# EAGLE design 7segement4digits1badidea-many-digits-mk-1 (EAGLE 6.5.0)
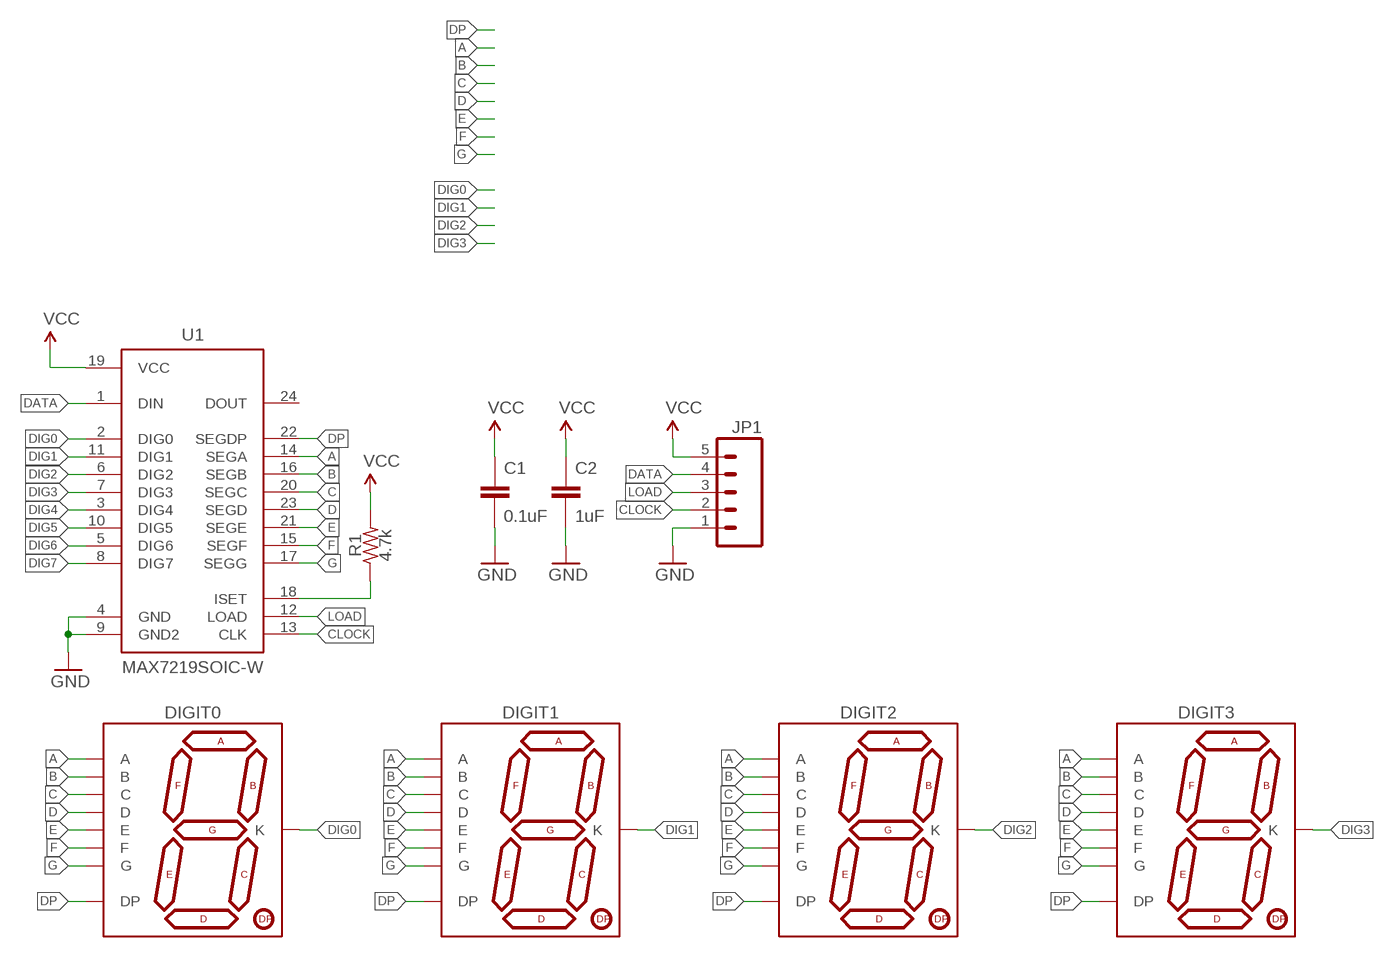
[diagram p0: schematic, sheet 1]

## Parts
C1  0.1uF  CAPACITOR-CERAMICC0603  [C0603]
C2  1uF  CAPACITOR-CERAMICC0805  [C0805]
DIGIT0  7SEG_1DIGPTH-10MM  [7SEG_1DIG_10MM]
DIGIT1  7SEG_1DIGPTH-10MM  [7SEG_1DIG_10MM]
DIGIT2  7SEG_1DIGPTH-10MM  [7SEG_1DIG_10MM]
DIGIT3  7SEG_1DIGPTH-10MM  [7SEG_1DIG_10MM]
JP1  M05JST-PH-VERT-PTH  [JST-5-PH-VERT-PTH]
R1  4.7k  RESISTORR0603  [R0603]
U1  MAX7219SOIC-W  [SO24W]

## Nets
A: DIGIT0.10(A) DIGIT1.10(A) DIGIT2.10(A) DIGIT3.10(A) U1.14(SEGA)
B: DIGIT0.9(B) DIGIT1.9(B) DIGIT2.9(B) DIGIT3.9(B) U1.16(SEGB)
C: DIGIT0.8(C) DIGIT1.8(C) DIGIT2.8(C) DIGIT3.8(C) U1.20(SEGC)
CLOCK: JP1.2 U1.13(CLK)
D: DIGIT0.5(D) DIGIT1.5(D) DIGIT2.5(D) DIGIT3.5(D) U1.23(SEGD)
DATA: JP1.4 U1.1(DIN)
DIG0: DIGIT0.1(K) DIGIT0.6(K) U1.2(DIG0)
DIG1: DIGIT1.1(K) DIGIT1.6(K) U1.11(DIG1)
DIG2: DIGIT2.1(K) DIGIT2.6(K) U1.6(DIG2)
DIG3: DIGIT3.1(K) DIGIT3.6(K) U1.7(DIG3)
DIG4: U1.3(DIG4)
DIG5: U1.10(DIG5)
DIG6: U1.5(DIG6)
DIG7: U1.8(DIG7)
DP: DIGIT0.7(DP) DIGIT1.7(DP) DIGIT2.7(DP) DIGIT3.7(DP) U1.22(SEGDP)
E: DIGIT0.4(E) DIGIT1.4(E) DIGIT2.4(E) DIGIT3.4(E) U1.21(SEGE)
F: DIGIT0.2(F) DIGIT1.2(F) DIGIT2.2(F) DIGIT3.2(F) U1.15(SEGF)
G: DIGIT0.3(G) DIGIT1.3(G) DIGIT2.3(G) DIGIT3.3(G) U1.17(SEGG)
GND: C1.2 C2.2 JP1.1 U1.4(GND) U1.9(GND2)
LOAD: JP1.3 U1.12(LOAD)
N$19: R1.1 U1.18(ISET)
VCC: C1.1 C2.1 JP1.5 R1.2 U1.19(VCC)
Unconnected: U1.24(DOUT)

## Library data of the parts
C1 C2 = A_butts:CAPACITOR-CERAMIC: CAPACITOR, European symbol
DIGIT0 DIGIT1-DIGIT3 = A_butts:7SEG_1DIG
JP1 = A_butts:M05: Header 5 Standard 5-pin 0.1" header. Use with straight break away headers (SKU : PRT-00116), right angle break away headers (PRT-00553), swiss pins (PRT-00743), machine pins (PRT-00117), and female headers (PRT-00115). Molex polarized connector foot print use with SKU : PRT-08230 with associated crimp pins and housings.
R1 = A_butts:RESISTOR: RESISTOR, American symbol
U1 = A_butts:MAX7219: 8-digit, 8-segment LED display driver, serial input

## Board
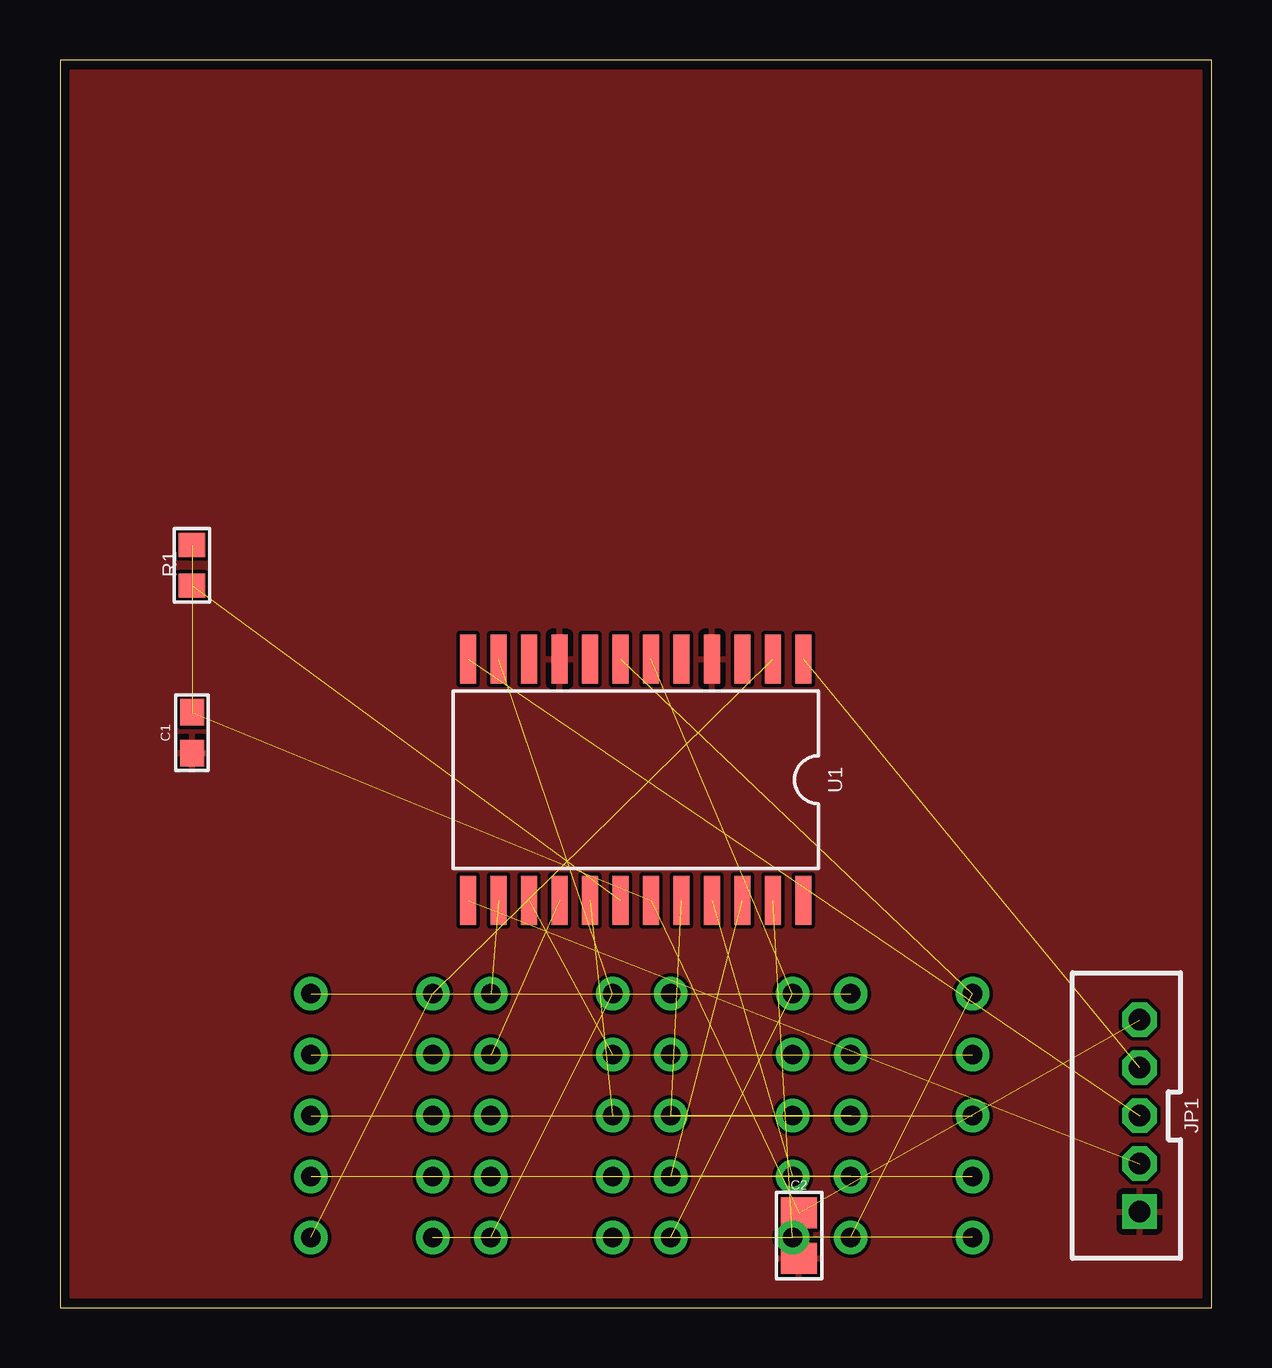
[diagram p1: board, top side]
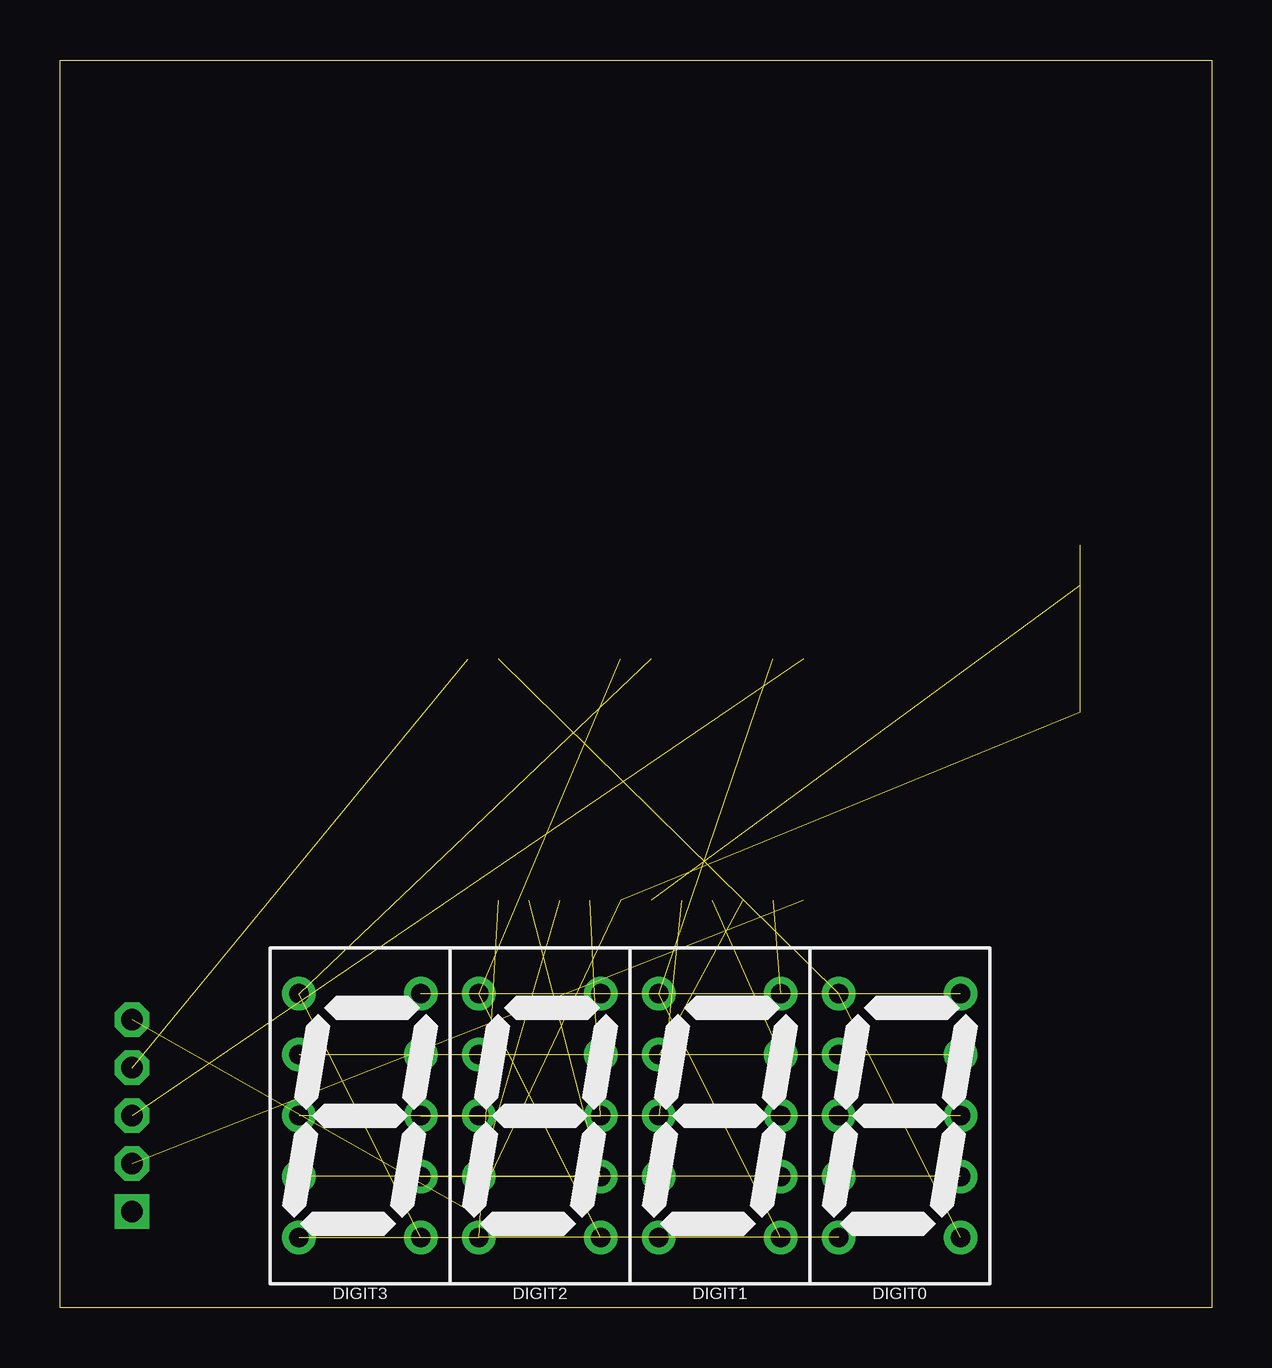
[diagram p2: board, bottom side, seen from below]

Size 48 x 52 mm. Coordinates in mm from the lower left corner, seen from the top.
Outline: 0,52 0,0 48,0 48,52 0,52
Copper layers (1*16): Top 0.0356mm / dielectric 1.5011mm / Bottom 0.0356mm
Design rules "LaenPCBOrder_2": minimum track width 6mil, minimum drill 13mil, track to track 6mil, track to pad 6mil, pad to pad 6mil, via to via 6mil, smd to smd 6mil, copper to edge 15mil, drill to drill 6mil, minimum pad ring 7mil, minimum via ring 7mil, stop-mask expansion 3mil, vias tented up to drill 20mil, thermal gap 10mil

### Footprints (pad centres in the part's own frame; a part is rotated, then mirrored left to right if it is on the bottom)
C0603 = smd 1.1 x 1: 1 -0.85,0; 2 0.85,0
C0805 = smd 1.3 x 1.5: 1 -0.95,0; 2 0.95,0
7SEG_1DIG_10MM = drill 0.8 pad 1.4: 1 -2.54,5.08; 2 -2.54,2.54; 3 -2.54,0; 4 -2.54,-2.54; 5 -2.54,-5.08; 6 2.54,-5.08; 7 2.54,-2.54; 8 2.54,0; 9 2.54,2.54; 10 2.54,5.08
JST-5-PH-VERT-PTH = drill 0.9 pad 1.422 square: 1 -4,0 | drill 0.9 pad 1.422 octagon: 2 -2,0; 3 0,0; 4 2,0; 5 4,0
R0603 = smd 1 x 1.1: 1 -0.85,0; 2 0.85,0
SO24W = smd 0.66 x 2.032: 1 -6.985,-5.029; 2 -5.715,-5.029; 3 -4.445,-5.029; 4 -3.175,-5.029; 5 -1.905,-5.029; 6 -0.635,-5.029; 7 0.635,-5.029; 8 1.905,-5.029; 9 3.175,-5.029; 10 4.445,-5.029; 11 5.715,-5.029; 12 6.985,-5.029; 13 6.985,5.029; 14 5.715,5.029; 15 4.445,5.029; 16 3.175,5.029; 17 1.905,5.029; 18 0.635,5.029; 19 -0.635,5.029; 20 -1.905,5.029; 21 -3.175,5.029; 22 -4.445,5.029; 23 -5.715,5.029; 24 -6.985,5.029

### Placement (x,y rotation side)
C1  5.5,23.96 270 top
C2  30.81,3 270 top
DIGIT0  13,8 0 bottom
DIGIT1  20.5,8 0 bottom
DIGIT2  28,8 0 bottom
DIGIT3  35.5,8 0 bottom
JP1  45,8 90 top
R1  5.5,30.94 90 top
U1  24,22 180 top

### Tracks (layer width: path | path; a pad name or v marks a point on that pad's centre or on a via)
A  (4 unrouted)
B  (4 unrouted)
C  (4 unrouted)
CLOCK  (1 unrouted)
D  (4 unrouted)
DATA  (1 unrouted)
DIG0  (2 unrouted)
DIG1  (2 unrouted)
DIG2  (2 unrouted)
DIG3  (2 unrouted)
DP  (4 unrouted)
E  (4 unrouted)
F  (4 unrouted)
G  (4 unrouted)
GND
  pour Top: 0,52 48,52 48,0 0,0
LOAD  (1 unrouted)
N$19  (1 unrouted)
VCC  (4 unrouted)